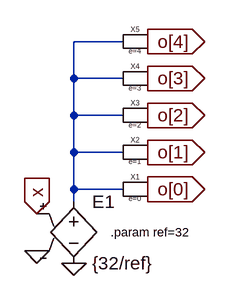
[diagram p0: schematic adc-5bit-fast.asc]
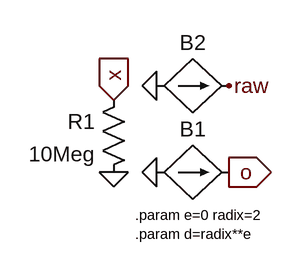
[diagram p1: sub-circuit adc_bit_extract.asc]
adc-5bit-fast.asc, the LTspice schematic file:
Version 4
SHEET 1 880 680
WIRE 176 -224 112 -224
WIRE 112 -176 112 -224
WIRE 176 -176 112 -176
WIRE 112 -128 112 -176
WIRE 176 -128 112 -128
WIRE 112 -80 112 -128
WIRE 176 -80 112 -80
WIRE 112 -32 112 -80
WIRE 176 -32 112 -32
WIRE 112 -16 112 -32
FLAG 208 -32 o[0]
IOPIN 208 -32 Out
FLAG 64 0 x
IOPIN 64 0 In
FLAG 64 48 0
FLAG 112 64 0
FLAG 208 -80 o[1]
IOPIN 208 -80 Out
FLAG 208 -128 o[2]
IOPIN 208 -128 Out
FLAG 208 -176 o[3]
IOPIN 208 -176 Out
FLAG 208 -224 o[4]
IOPIN 208 -224 Out
SYMBOL adc_bit_extract 192 -32 R0
WINDOW 39 0 19 Bottom 0
SYMATTR InstName X1
SYMATTR SpiceLine e=0
SYMBOL e 112 -32 R0
SYMATTR InstName E1
SYMATTR Value {32/ref}
SYMBOL adc_bit_extract 192 -80 R0
WINDOW 39 0 19 Bottom 0
SYMATTR InstName X2
SYMATTR SpiceLine e=1
SYMBOL adc_bit_extract 192 -128 R0
WINDOW 39 0 19 Bottom 0
SYMATTR InstName X3
SYMATTR SpiceLine e=2
SYMBOL adc_bit_extract 192 -176 R0
WINDOW 39 0 19 Bottom 0
SYMATTR InstName X4
SYMATTR SpiceLine e=3
SYMBOL adc_bit_extract 192 -224 R0
WINDOW 39 0 19 Bottom 0
SYMATTR InstName X5
SYMATTR SpiceLine e=4
TEXT 160 24 Left 1 !.param ref=32

adc_bit_extract.asc, the sub-circuit schematic file:
Version 4
SHEET 1 880 680
FLAG 256 208 o
IOPIN 256 208 Out
FLAG 176 208 0
FLAG 128 208 0
FLAG 128 128 x
IOPIN 128 128 In
FLAG 256 112 raw
FLAG 176 112 0
SYMBOL bi 176 208 R270
WINDOW 0 32 40 VTop 2
WINDOW 3 -32 65 Invisible 2
SYMATTR InstName B1
SYMATTR Value I=V(raw)-int(V(raw)/radix)*radix
SYMATTR Value2 Rpar=1
SYMBOL res 144 112 M0
SYMATTR InstName R1
SYMATTR Value 10Meg
SYMBOL bi 176 112 R270
WINDOW 0 32 40 VTop 2
WINDOW 3 -32 65 Invisible 2
SYMATTR InstName B2
SYMATTR Value I=int(V(x)/d)
SYMATTR Value2 Rpar=1
TEXT 152 256 Left 1 !.param e=0 radix=2\n.param d=radix**e

The netlist it stands for:
* adc-5bit-fast.asc
XX1 o[0] N001 adc_bit_extract params: e=0
E1 N001 0 x 0 {32/ref}
XX2 o[1] N001 adc_bit_extract params: e=1
XX3 o[2] N001 adc_bit_extract params: e=2
XX4 o[3] N001 adc_bit_extract params: e=3
XX5 o[4] N001 adc_bit_extract params: e=4

* block symbol definitions
.subckt adc_bit_extract o x
B1 0 o I=V(raw)-int(V(raw)/radix)*radix Rpar=1
R1 x 0 10Meg
B2 0 raw I=int(V(x)/d) Rpar=1
.param e=0 radix=2
.param d=radix**e
.ends adc_bit_extract

.param ref=32
.backanno
.end